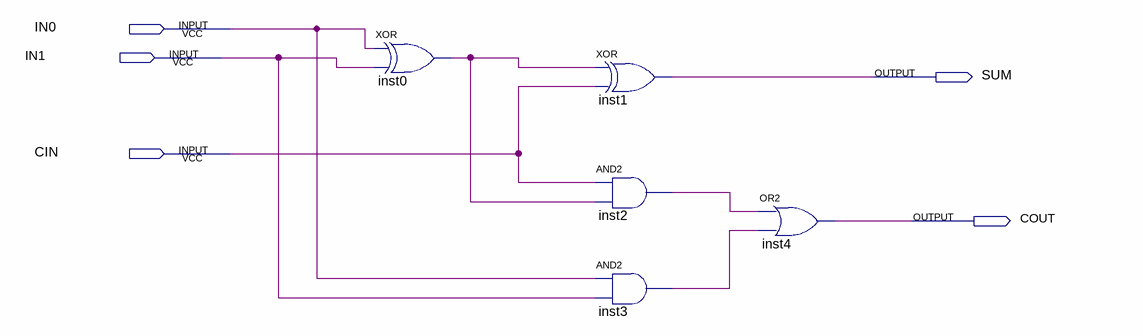
[diagram p0: schematic sheet]
// Quartus schematic FA1.bdf as structural Verilog: 5 symbols, 5 pins
module FA1 (
  input  IN0,
  input  IN1,
  input  CIN,
  output SUM,
  output COUT
);

  wire inst0_out, inst2_out, inst3_out;

  xor inst0 (inst0_out, IN0, IN1);
  xor inst1 (SUM, inst0_out, CIN);
  and inst2 (inst2_out, CIN, inst0_out);
  and inst3 (inst3_out, IN0, IN1);
  or inst4 (COUT, inst2_out, inst3_out);
endmodule
